# Altium schematic sheet Lcd.SchDoc
size 420 x 297 mm; DocumentNumber: Lcd
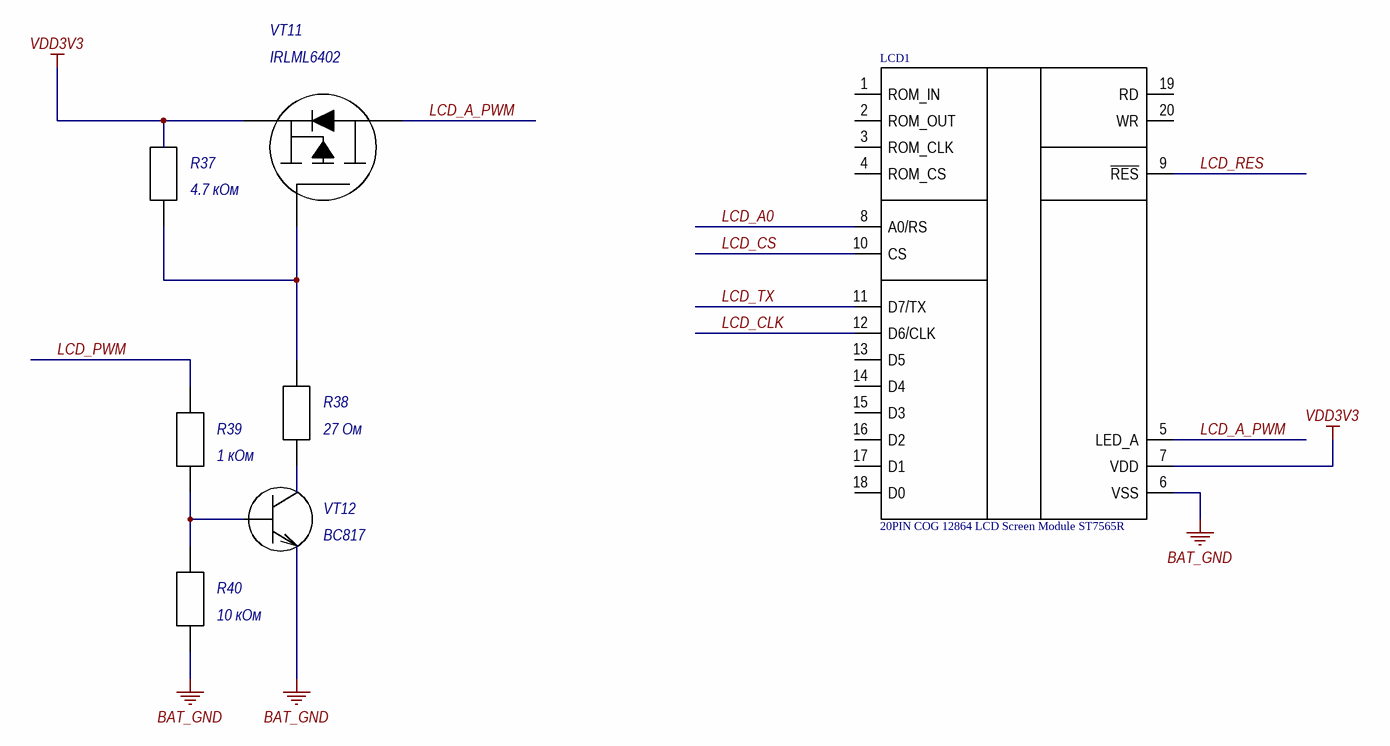
[diagram p0: Lcd.SchDoc]

## Parts
LCD1  20PIN COG 12864 LCD Screen Module ST7565R  [COG 12864 LCD Screen Module ST7565R]
R37  4.7 кОм  [RES 0402]
R38  27 Ом  [RES 0402]
R39  1 кОм  [RES 0402]
R40  10 кОм  [RES 0402]
VT11  IRLML6402  [SOT-23]
VT12  BC817  [SOT-23]

## Nets
BAT_GND: LCD1.6(VSS) R40.1 VT12.2(E)
VDD3V3: LCD1.7(VDD) R37.2 VT11.2(S)
LCD_A0: LCD1.8(A0/RS)
LCD_A_PWM: LCD1.5(LED_A) VT11.3(D)
LCD_CLK: LCD1.12(D6/CLK)
LCD_CS: LCD1.10(CS)
LCD_PWM: R39.2
LCD_RES: LCD1.9(~{RES})
LCD_TX: LCD1.11(D7/TX)
NetR37_1: R37.1 R38.2 VT11.1(G)
NetR38_1: R38.1 VT12.3(C)
NetR39_1: R39.1 R40.2 VT12.1(B)

Not connected (* = marked no-connect by the designer): LCD1 1(ROM_IN) 2(ROM_OUT) 3(ROM_CLK) 4(ROM_CS) 13(D5) 14(D4) 15(D3) 16(D2) 17(D1) 18(D0) 19(RD) 20(WR)

## Notes on the sheet
- Подп. и дата
- Инв. № дубл.
- Взам. инв. №
- Инв. № подл.
- Лист
- Изм.
- № докум.
- Подп.
- Дата
- Копировал
- Формат А3

## Library data of the parts
R37-R40 = RES 0402
VT12 = BC817: NPN general-purpose transistor; Manufacturer: NXP; Structure: n-p-n; Type: Транзистор биполярный; hFE: 160 ... 600; Max collector-emitter voltage: 45 В; Max collector-base voltage: 50 В; Max emitter-base voltage: 5 В; Max collector current: 0,5 А; Max collector peak current: 1 А; Power dissitipation: 0,25 Вт; fT: 100 МГц; Collector-emitter saturation voltage: 0,7 В; Base-emitter on voltage: 1,2 В; Specitication: ЭКБ ИП; Collector-base сapacitance: 3 пФ; Complement: BC807; Temperature range: -65 ... 150 °C